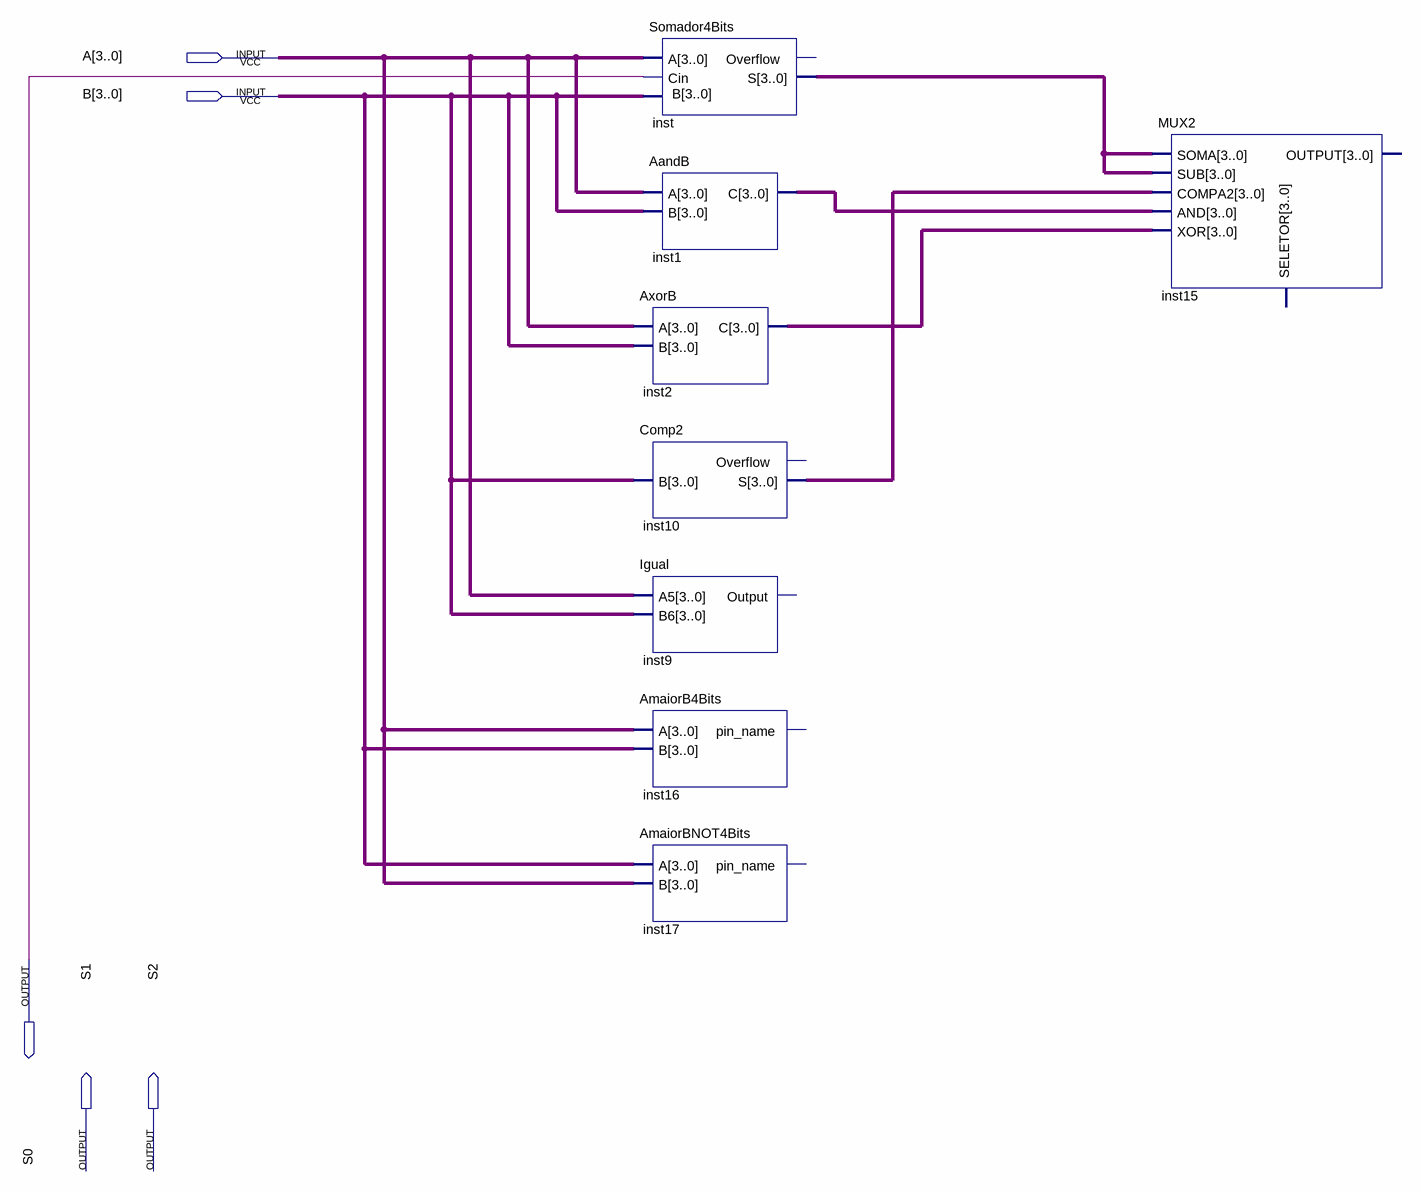
[diagram p0: schematic sheet]
// Quartus schematic MUXFINAL.bdf as structural Verilog: 8 symbols, 5 pins
module MUXFINAL (
  input  [3:0] A,
  input  [3:0] B,
  output S0,
  output S1,
  output S2
);

  wire [3:0] inst1_c, inst2_c, inst10_s, inst_s;

  Somador4Bits inst (.A(A), .B(B), .Cin(S0), .S(inst_s));  // open: Overflow
  AandB inst1 (.A(A), .B(B), .C(inst1_c));
  AxorB inst2 (.A(A), .B(B), .C(inst2_c));
  Comp2 inst10 (.B(B), .S(inst10_s));  // open: Overflow
  Igual inst9 (.A5(A), .B6(B));  // open: Output
  AmaiorB4Bits inst16 (.A(A), .B(B));  // open: pin_name
  AmaiorBNOT4Bits inst17 (.A(B), .B(A));  // open: pin_name
  MUX2 inst15 (.SOMA(inst_s), .SUB(inst_s), .COMPA2(inst10_s), .AND(inst1_c), .XOR(inst2_c));  // open: SELETOR, OUTPUT
endmodule
